# Altium schematic sheet 01_DesignBlock.SchDoc
size 420 x 297 mm
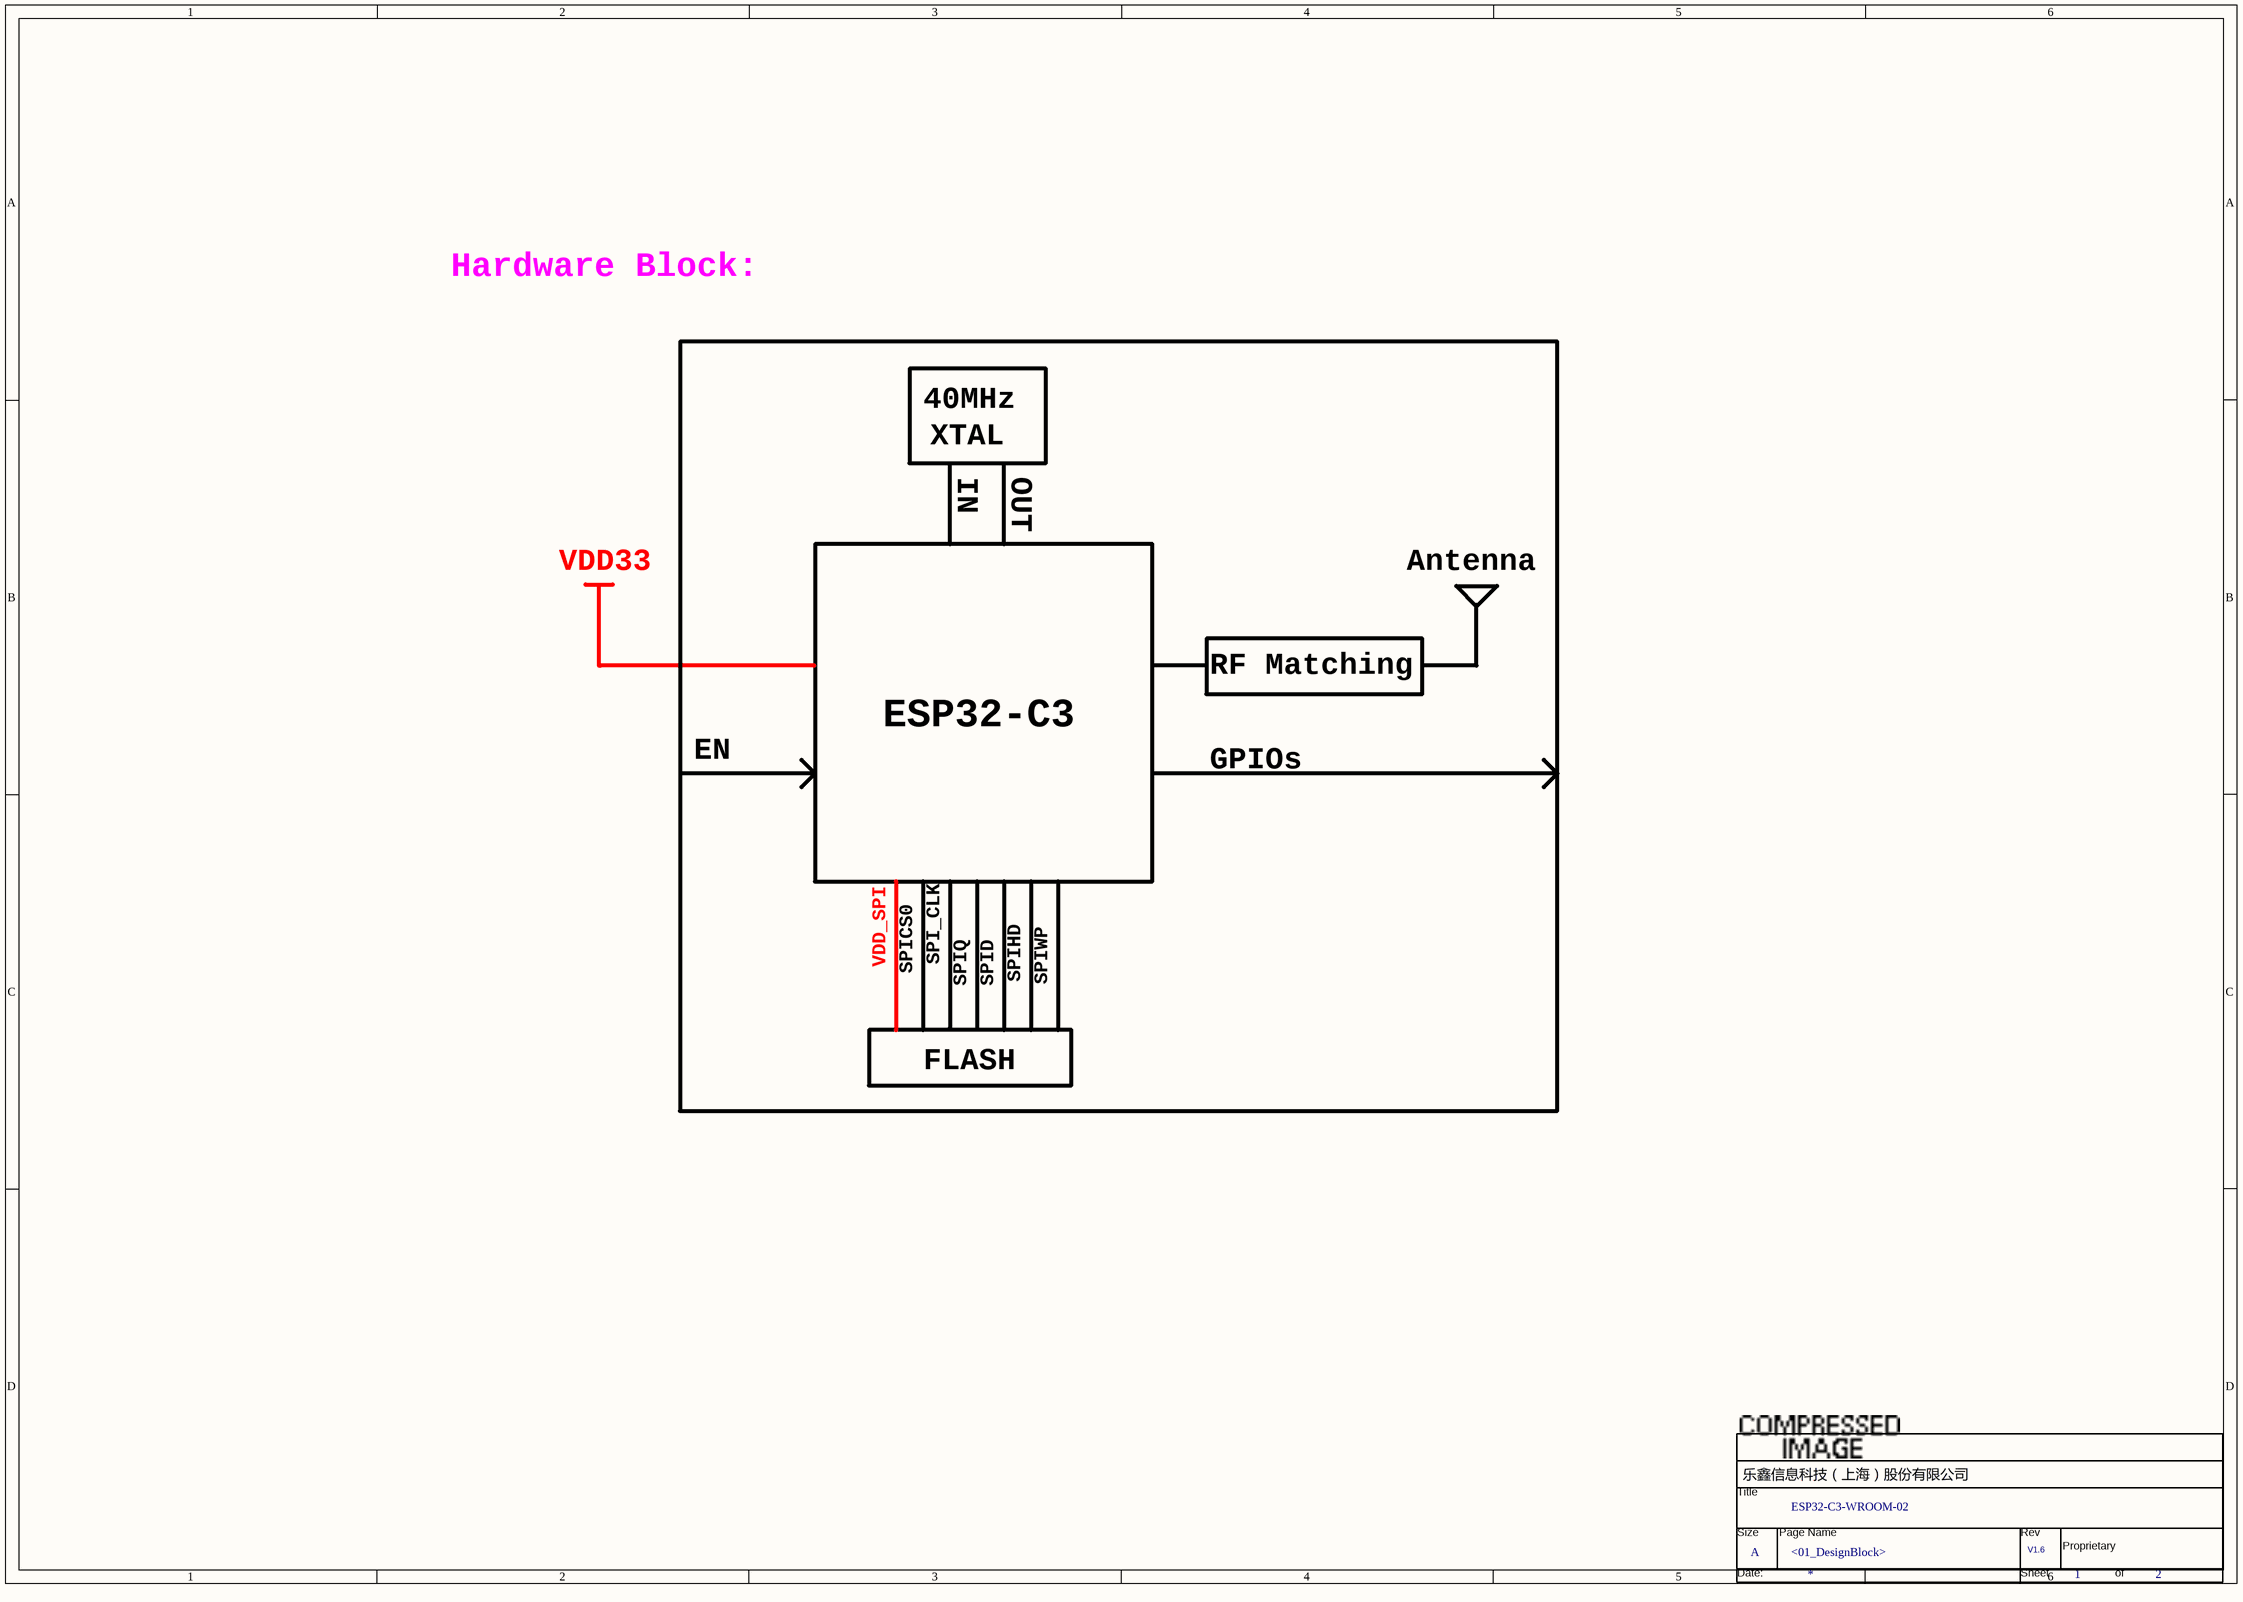
[diagram p0: 01_DesignBlock.SchDoc]

## Parts
*  Doc: <01_DesignBlock>  Title: ESP32-C3-WROOM-02  Page Size: A  Page Number: 1  Page Count: 2  RevCode: V1.6  (hidden comment: espTitleBlock3)  (graphical)

## Notes on the sheet
- Hardware Block:
- 40MHz
- XTAL
- IN
- OUT
- VDD33
- Antenna
- ESP32-C3
- RF Matching
- EN
- GPIOs
- VDD_SPI
- SPICS0
- SPI_CLK
- SPIQ
- SPID
- SPIHD
- SPIWP
- FLASH
- (in symbol espTitleBlock3) Title; Size; Page Name; Rev; Proprietary; Date:; Sheet; of

## Library data of the parts
* = espTitleBlock3: Page Name: V; Page Create Date: March  8, 1995; Page Modify Date: *